# Altium schematic sheet Test_Jig_PPM-Encoder.SchDoc
size A2; DrawnBy: Philip Rowse
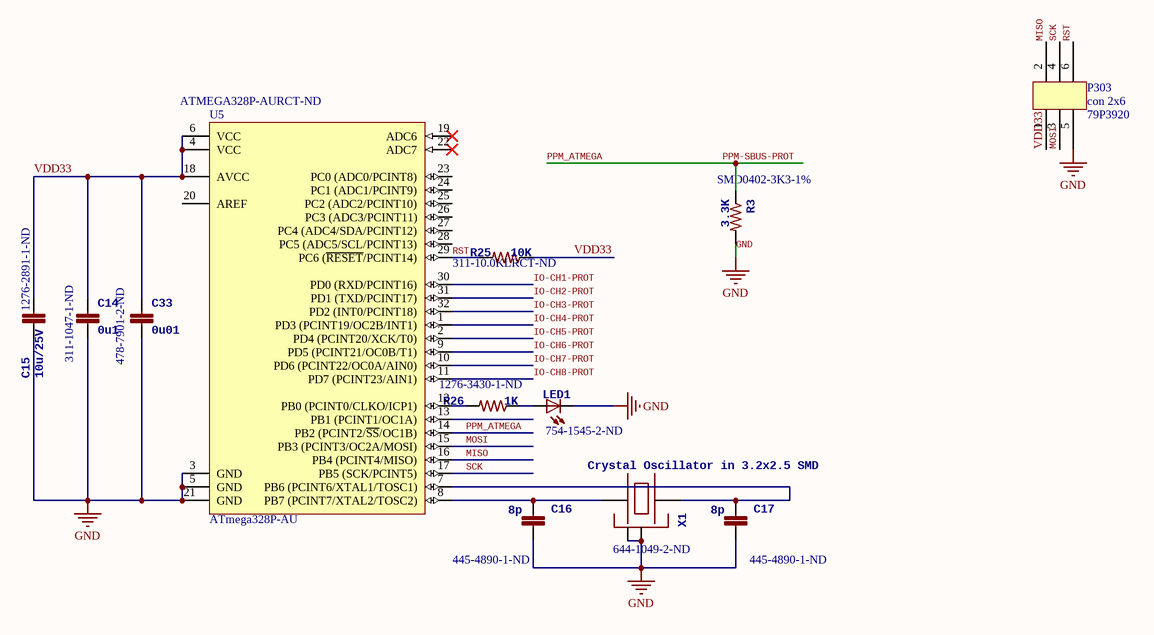
[diagram p0: Test_Jig_PPM-Encoder.SchDoc]

## Parts
C14  0u1  Supplier Part Number 1: 311-1047-1-ND  [0402-CAP]
C15  10u/25V  Supplier Part Number 1: 1276-2891-1-ND  [0805-CAP]
C16  8p  Supplier Part Number 1: 445-4890-1-ND  [0402-CAP]
C17  8p  Supplier Part Number 1: 445-4890-1-ND  [0402-CAP]
C33  0u01  Supplier Part Number 1: 478-7901-2-ND  [0603-CAP]
LED1  Supplier Part Number 1: 754-1545-2-ND  [0603-LED-Blue]  (hidden comment: LED0603_Green)
P303  con 2x6  Supplier Part Number 1: 79P3920  [TSW-103-07-G-D]
R3  3.3K  Supplier Part Number 1: SMD0402-3K3-1%  [C0402]
R25  10K  Supplier Part Number 1: 311-10.0KLRCT-ND  [0402-RES]
R26  1K  Supplier Part Number 1: 1276-3430-1-ND  [0402-RES]
U5  ATmega328P-AU  Supplier Part Number 1: ATMEGA328P-AURCT-ND  [32A_N]
X1  Crystal Oscillator in 3.2x2.5 SMD  Supplier Part Number 1: 644-1049-2-ND  [OSCILLATOR-3.2X2.5]

## Nets
GND: C14.P$2 C15.P$2 C16.P$1 C17.P$1 C33.P$2 LED1.C P303.5 R3.2 U5.3(GND) U5.5(GND) U5.21(GND) X1.2(NC_2) X1.4(NC_4)
IO-CH1-PROT: U5.30(PD0_(RXD/PCINT16))
IO-CH2-PROT: U5.31(PD1_(TXD/PCINT17))
IO-CH3-PROT: U5.32(PD2_(INT0/PCINT18))
IO-CH4-PROT: U5.1(PD3_(PCINT19/OC2B/INT1))
IO-CH5-PROT: U5.2(PD4_(PCINT20/XCK/T0))
IO-CH6-PROT: U5.9(PD5_(PCINT21/OC0B/T1))
IO-CH7-PROT: U5.10(PD6_(PCINT22/OC0A/AIN0))
IO-CH8-PROT: U5.11(PD7_(PCINT23/AIN1))
MISO: P303.2 U5.16(PB4_(PCINT4/MISO))
MOSI: P303.3 U5.15(PB3_(PCINT3/OC2A/MOSI))
PPM-SBUS-PROT: R3.1 U5.14(PB2_(PCINT2/~{SS}/OC1B))  [also labelled PPM_ATMEGA]
RST: P303.6 R25.P$2 U5.29(PC6_(~{RESET}/PCINT14))
SCK: P303.4 U5.17(PB5_(SCK/PCINT5))
VDD33: C14.P$1 C15.P$1 C33.P$1 P303.1 R25.P$1 U5.4(VCC) U5.6(VCC) U5.18(AVCC)
NetC16_P$2: C16.P$2 U5.8(PB7_(PCINT7/XTAL2/TOSC2)) X1.1
NetC17_P$2: C17.P$2 U5.7(PB6_(PCINT6/XTAL1/TOSC1)) X1.3
NetLED1_A: LED1.A R26.P$1
NetR26_P$2: R26.P$2 U5.12(PB0_(PCINT0/CLKO/ICP1))

Not connected (* = marked no-connect by the designer): U5 13(PB1_(PCINT1/OC1A)) 19(ADC6)* 20(AREF) 22(ADC7)* 23(PC0_(ADC0/PCINT8)) 24(PC1_(ADC1/PCINT9)) 25(PC2_(ADC2/PCINT10)) 26(PC3_(ADC3/PCINT11)) 27(PC4_(ADC4/SDA/PCINT12)) 28(PC5_(ADC5/SCL/PCINT13))

## Notes on the sheet
- Title
- Size:
- Date:
- File:
- A2
- Number:
- Time:
- Revision:
- Sheet
- of

## Library data of the parts
C14 = CAP0402: CAP CER 0.1UF 16V Y5V 0402; PARTNO: CC0402ZRY5V7BB104; 3DR_PARTNO: ECM0700; Supplier 1: Digi-Key; Value: 0u1
C15 = CAP0805: CAP CER 10UF 25V 10% X5R 0805; PARTNO: CL21A106KAYNNNE; 3DR_PARTNO: ECM0714; Value: 10u/25; Supplier 1: Digi-Key
C16 C17 = CAP0402: CAP CER 8PF 50V C0G 0402; PARTNO: C1005C0G1H080C; 3DR_PARTNO: ECM0710; Supplier 1: Digi-Key; Value: 8p
C33 = CAP0603: CAP CER 10000PF 25V 5% X7R 0603; PARTNO: 06033C103JAT2A; 3DR_PARTNO: ECM0620; Supplier 1: Digi-Key; Value: 0u01
LED1 = LED0603_Blue: LED GREEN ROUND CLEAR SMD; 3DR_PARTNO: ECM0494; PARTNO: APTD1608CGCK; Supplier 1: Digi-Key; Value: GREEN
P303 = con 2x6: Connector, Header, 6Pos, 2.54MM, Vert, THT, Au; 3DR_PARTNO: PRT0445; Supplier 1: Newark
R3 = RESISTOR0402: Supplier 1: TME
R25 = RESISTOR0402-RES: RES 10K OHM 1/16W 1% 0402 SMD; PARTNO: RC0402FR-0710KL; 3DR_PARTNO: ECM0800; Supplier 1: Digi-Key; Value: 10K
R26 = RESISTOR0402-RES: RES 1K OHM 1/16W 1% 0402; PARTNO: RC1005F102CS; 3DR_PARTNO: ECM0804; Supplier 1: Digi-Key; Value: 1K
U5 = ATmega328P-AU: 8-bit AVR Microcontroller, 32KB Flash, 1KB EEPROM, 2KB SRAM, 32-pin TQFP, Industrial Grade (-40°C to 85°C); DatasheetVersion: revD, May-2011; PackageVersion: revC, Oct-2010; PackageReference: 32A; PackageDescription: 32-Lead, 7x7x1.0 mm Body, 0.8mm Lead Pitch, Thin Profile Plastic Quad Flat Package (TQFP); Code_JEDEC: MS-026-ABA; ComponentLink1Description: Manufacturer URL; ComponentLink1URL: http://www.atmel.com/; ComponentLink2Description: ATmega48A/48PA/88A/88PA/168A/168PA/328/328P Datasheet; ComponentLink2URL: http://www.atmel.com/dyn/resources/prod_documents/doc8271.pdf; ComponentLink3Description: ATmega48A/48PA/88A/88PA/168A/168PA/328/328P Summary; ComponentLink3URL: http://www.atmel.com/dyn/resources/prod_documents/8271S.pdf; Supplier 1: Digi-Key
X1 = OSCILLATOR-3.2X2.5: CRYSTAL 16MHZ 8PF SMD; PARTNO: NX3225SA-16.000MHZ-STD-CSR-1; Supplier 1: Digi-Key; Value: 16MHz